# Altium schematic sheet drivers.SchDoc
size A4; SheetNumber: 4; SheetTotal: 4
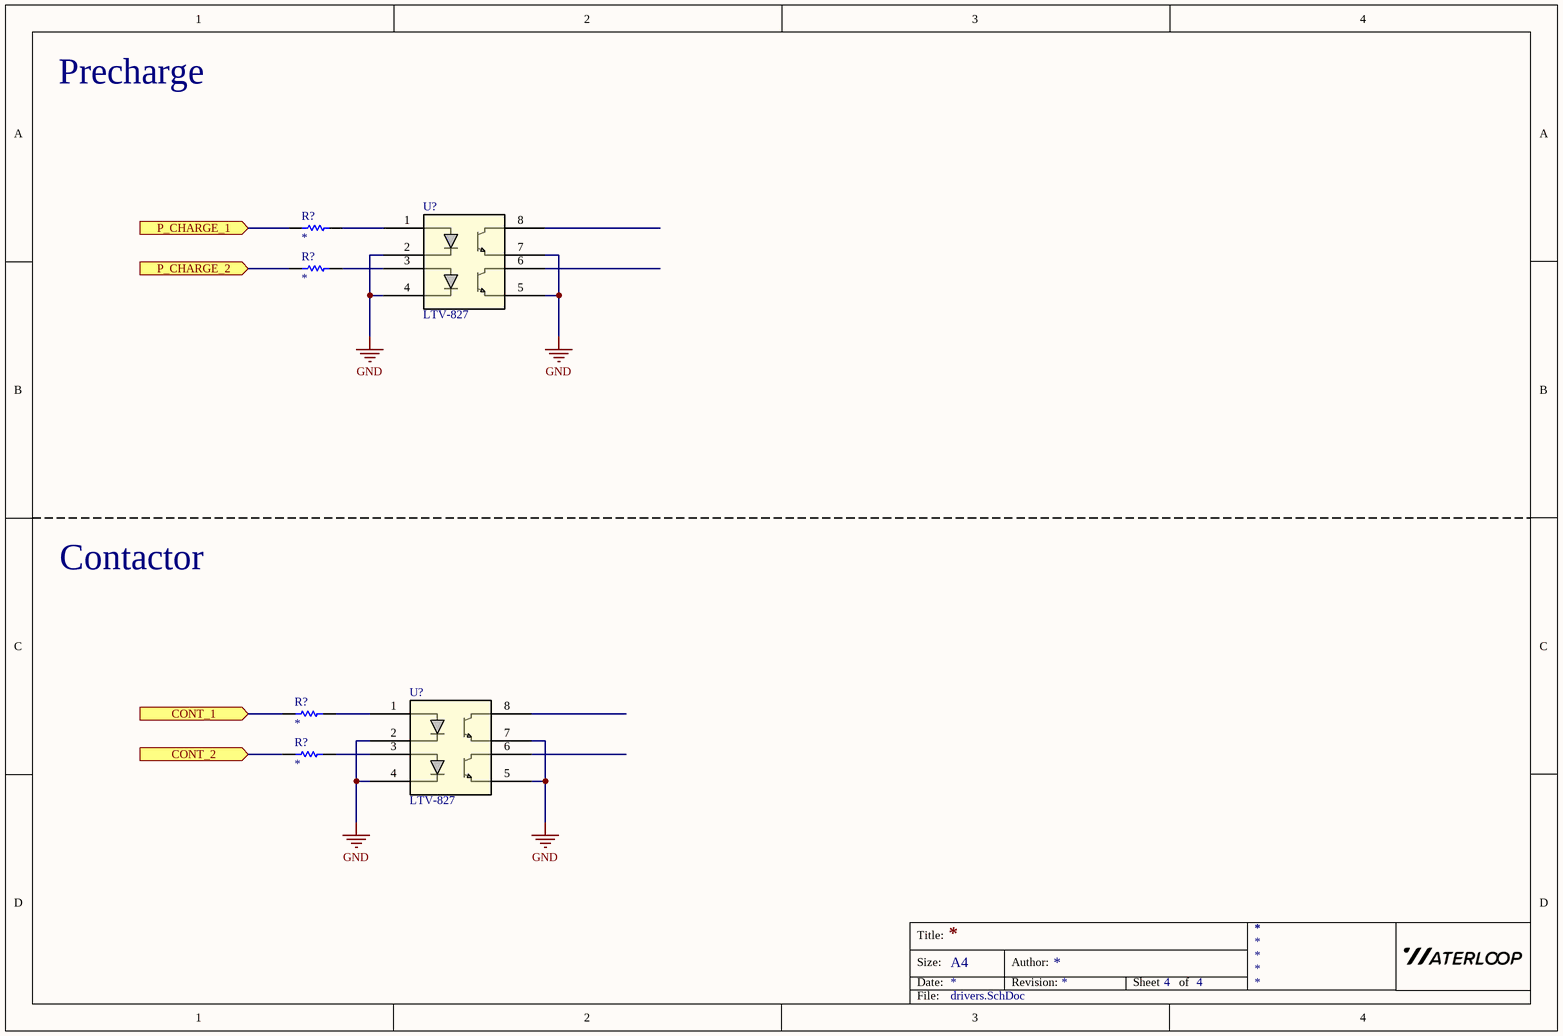
[diagram p0: drivers.SchDoc]

## Parts
(Parts that share a designator on the sheet are numbered #1, #2 ... from top to bottom, then left to right.)
R?#1  Resistor  [0603 - Resistor]  (value not drawn)
R?#2  Resistor  [0603 - Resistor]  (value not drawn)
R?#3  Resistor  [0603 - Resistor]  (value not drawn)
R?#4  Resistor  [0603 - Resistor]  (value not drawn)
U?#1  LTV-827  [LTV-827_LTO]
U?#2  LTV-827  [LTV-827_LTO]

## Ports
CONT_1 (in), CONT_2 (in), P_CHARGE_1 (in), P_CHARGE_2 (in)

## Nets
GND: U?#1.2 U?#1.4 U?#1.5 U?#1.7 U?#2.2 U?#2.4 U?#2.5 U?#2.7
CONT_1: R?#3.1 ; port CONT_1
CONT_2: R?#4.1 ; port CONT_2
P_CHARGE_1: R?#1.1 ; port P_CHARGE_1
P_CHARGE_2: R?#2.1 ; port P_CHARGE_2
NetR?#1_2: R?#1.2 U?#1.1
NetR?#2_2: R?#2.2 U?#1.3
NetR?#3_2: R?#3.2 U?#2.1
NetR?#4_2: R?#4.2 U?#2.3

Not connected (* = marked no-connect by the designer): U?#1 6 8; U?#2 6 8

## Notes on the sheet
- Precharge
- Contactor
- Title:
- Size:
- Date:
- A4
- Author:
- Revision:
- Sheet
- of
- File:

## Library data of the parts
U?#1 U?#2 = LTV-827: Optoisolator Transistor Output 5000Vrms 2 Channel 8-DIP; Mfr_Name: LITE-ON; Copyright: Copyright (C) 2022 Ultra Librarian. All rights reserved.; Manufacturer_Part_Number: LTV-827; Digi-Key_Part_Number_1: 160-1368-5-ND; RefDes: RefDes; Type: DEV
R?#1-R?#4 = Resistor: Rating: *; Manufacturer Part Number: *; Manufacturer: *; Supplier Part Number: *; Supplier: *; Value: *